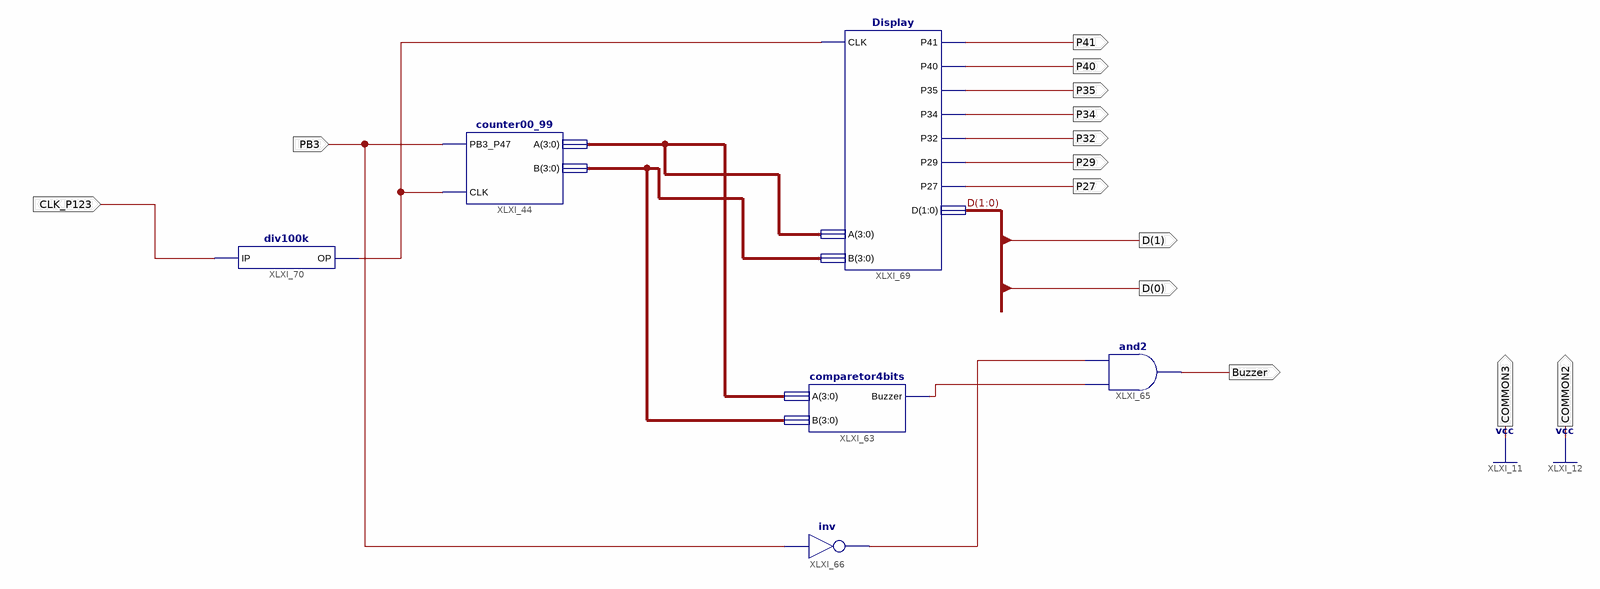
[diagram p0: schematic sheet 1]
// Xilinx ISE schematic Lab6.sch (spartan6) as structural Verilog: 6 symbols, 14 ports
module Lab6 (
  input  PB3,
  input  CLK_P123,
  output Buzzer,
  output P41,
  output P40,
  output P35,
  output P34,
  output P32,
  output P29,
  output P27,
  output [1:0] D,
  output COMMON2,
  output COMMON3
);

  wire XLXN_18, XLXN_30, XLXN_33;
  wire [3:0] XLXN_3, XLXN_4;

  counter00_99 XLXI_44 (.PB3_P47(PB3), .CLK(XLXN_18), .A(XLXN_3), .B(XLXN_4));
  comparetor4bits XLXI_63 (.A(XLXN_3), .B(XLXN_4), .Buzzer(XLXN_30));
  and XLXI_65 (Buzzer, XLXN_30, XLXN_33);
  not XLXI_66 (XLXN_33, PB3);
  Display XLXI_69 (
    .A(XLXN_3), .B(XLXN_4), .CLK(XLXN_18), .D(D), .P41(P41), .P35(P35), .P34(P34), .P32(P32), .P27(P27),
    .P40(P40), .P29(P29));
  div100k XLXI_70 (.IP(CLK_P123), .OP(XLXN_18));

  assign COMMON2 = 1'b1;
  assign COMMON3 = 1'b1;
endmodule
